# EAGLE design LP55231_breakout (EAGLE 7.5.0)
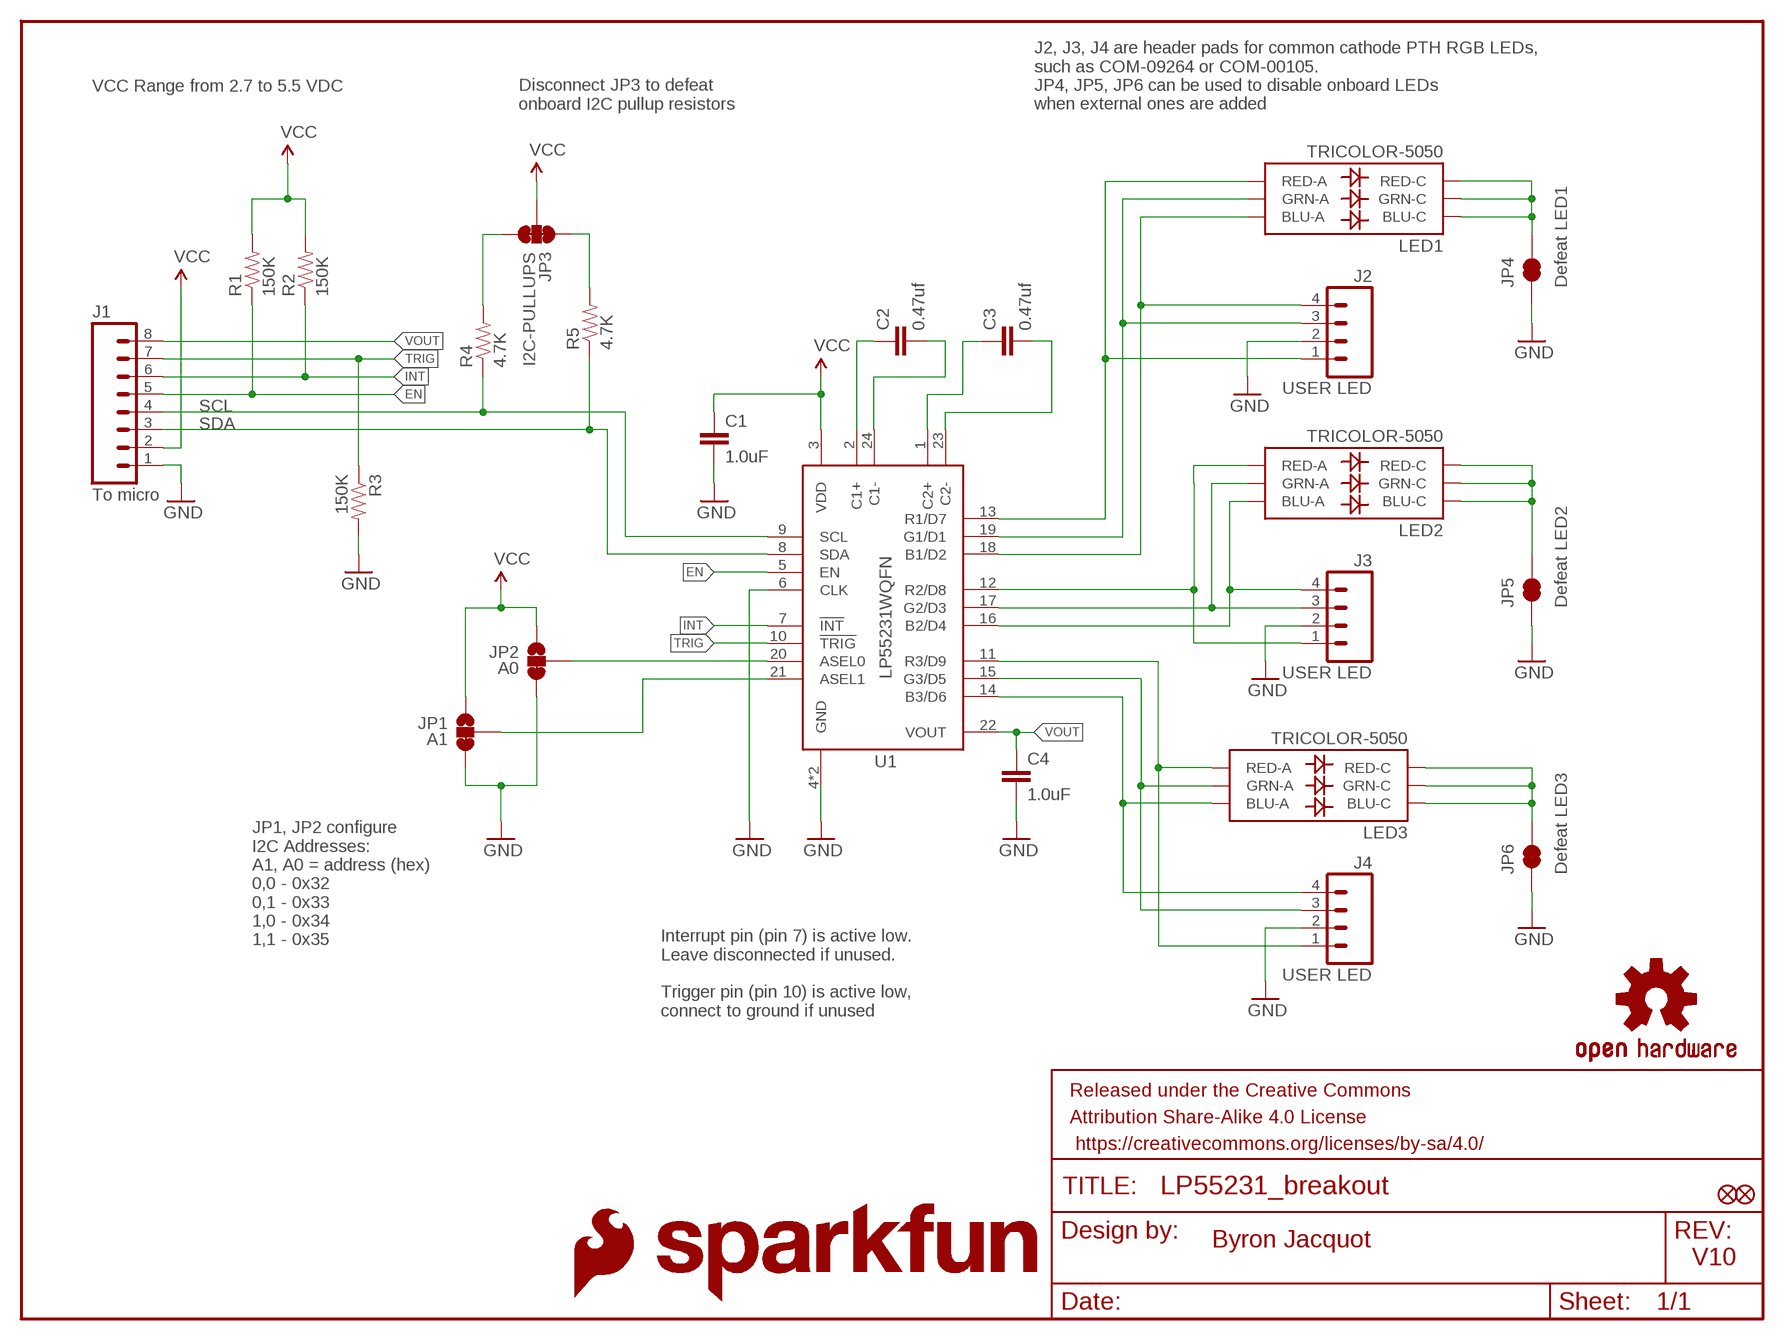
[diagram p0: schematic, sheet 1]

## Parts
C1  1.0uF  1.0UF-16V-10%(0603)  [0603-CAP]
C2  0.47uf  CAP0603-CAP  [0603-CAP]
C3  0.47uf  CAP0603-CAP  [0603-CAP]
C4  1.0uF  1.0UF-16V-10%(0603)  [0603-CAP]
FD1  FIDUCIALUFIDUCIAL  [MICRO-FIDUCIAL]
FD2  FIDUCIALUFIDUCIAL  [MICRO-FIDUCIAL]
FRAME1  FRAME-LETTER  [CREATIVE_COMMONS]
J1  To micro  M08NO_SILK_FEMALE_PTH  [1X08_NO_SILK]
J2  USER LED  M04NO_SILK_ALL_ROUND  [1X04_NO_SILK_ALL_ROUND]
J3  USER LED  M04NO_SILK_ALL_ROUND  [1X04_NO_SILK_ALL_ROUND]
J4  USER LED  M04NO_SILK_ALL_ROUND  [1X04_NO_SILK_ALL_ROUND]
JP1  A1  JUMPER-PAD-3-2OF3_NC_BY_TRACE_SMALL  [PAD-JUMPER-3-2OF3_NC_BY_TRACE_YES_SILK_FULL_BOX]
JP2  A0  JUMPER-PAD-3-2OF3_NC_BY_TRACE_SMALL  [PAD-JUMPER-3-2OF3_NC_BY_TRACE_YES_SILK_FULL_BOX]
JP3  I2C-PULLUPS  JUMPER-PAD-3-NC_BY_TRACE  [PAD-JUMPER-3-3OF3_NC_BY_TRACE_YES_SILK_FULL_BOX]
JP4  Defeat LED1  JUMPER-PAD-2-NC_BY_TRACENO_SILK  [PAD-JUMPER-2-NC_BY_TRACE_NO_SILK]
JP5  Defeat LED2  JUMPER-PAD-2-NC_BY_TRACENO_SILK  [PAD-JUMPER-2-NC_BY_TRACE_NO_SILK]
JP6  Defeat LED3  JUMPER-PAD-2-NC_BY_TRACENO_SILK  [PAD-JUMPER-2-NC_BY_TRACE_NO_SILK]
LED1  TRICOLOR-5050  LED-TRICOLOR-5050NO_IC  [LED-TRICOLOR-5050]
LED2  TRICOLOR-5050  LED-TRICOLOR-5050NO_IC  [LED-TRICOLOR-5050]
LED3  TRICOLOR-5050  LED-TRICOLOR-5050NO_IC  [LED-TRICOLOR-5050]
LOGO1  SFE_LOGO_FLAME.1_INCH  [SFE_LOGO_FLAME_.1]
LOGO2  SFE_LOGO_NAME.1_INCH  [SFE_LOGO_NAME_.1]
LOGO3  OSHW-LOGOS  [OSHW-LOGO-S]
R1  150K  150KOHM1/10W1%(0603)  [0603-RES]
R2  150K  150KOHM1/10W1%(0603)  [0603-RES]
R3  150K  150KOHM1/10W1%(0603)  [0603-RES]
R4  4.7K  4.7KOHM-1/10W-1%(0603)  [0603-RES]
R5  4.7K  4.7KOHM-1/10W-1%(0603)  [0603-RES]
U1  LP55231WQFN  [WQFN-24]

## Nets
ADDR0: JP2.2 U1.20(ASEL0)
ADDR1: JP1.2 U1.21(ASEL1)
B1: J2.4 LED1.3(BLU-A) U1.18(B1/D2)
B2: J3.4 LED2.3(BLU-A) U1.16(B2/D4)
B3: J4.4 LED3.3(BLU-A) U1.14(B3/D6)
EN: J1.5 R1.1 U1.5(EN)
G1: J2.3 LED1.1(GRN-A) U1.19(G1/D1)
G2: J3.3 LED2.1(GRN-A) U1.17(G2/D3)
G3: J4.3 LED3.1(GRN-A) U1.15(G3/D5)
GND: C1.2 C4.2 J1.1 J2.2 J3.2 J4.2 JP1.3 JP2.3 JP4.1 JP5.1 JP6.1 R3.2 U1.4(GND) U1.6(CLK) U1.EP(GND)
INT: J1.6 R2.1 U1.7(!INT)
N$1: JP6.2 LED3.4(BLU-C) LED3.5(RED-C) LED3.6(GRN-C)
N$2: JP5.2 LED2.4(BLU-C) LED2.5(RED-C) LED2.6(GRN-C)
N$3: JP4.2 LED1.4(BLU-C) LED1.5(RED-C) LED1.6(GRN-C)
N$11: C2.1 U1.2(C1+)
N$12: C2.2 U1.24(C1-)
N$13: C3.1 U1.1(C2+)
N$14: C3.2 U1.23(C2-)
N$21: JP3.1 R5.2
N$22: JP3.3 R4.2
R1: J2.1 LED1.2(RED-A) U1.13(R1/D7)
R2: J3.1 LED2.2(RED-A) U1.12(R2/D8)
R3: J4.1 LED3.2(RED-A) U1.11(R3/D9)
SCL: J1.4 R4.1 U1.9(SCL)
SDA: J1.3 R5.1 U1.8(SDA)
TRIG: J1.7 R3.1 U1.10(!TRIG)
VCC: C1.1 J1.2 JP1.1 JP2.1 JP3.2 R1.2 R2.2 U1.3(VDD)
VOUT: C4.1 J1.8 U1.22(VOUT)

## Notes on the sheet
- VCC Range from 2.7 to 5.5 VDC
- Disconnect JP3 to defeat
  onboard I2C pullup resistors
- J2, J3, J4 are header pads for common cathode PTH RGB LEDs,
  such as COM-09264 or COM-00105.  
  JP4, JP5, JP6 can be used to disable onboard LEDs 
  when external ones are added
- JP1, JP2 configure
  I2C Addresses:
  A1, A0 = address (hex)
  0,0 - 0x32
  0,1 - 0x33
  1,0 - 0x34
  1,1 - 0x35
- Interrupt pin (pin 7) is active low.  
  Leave disconnected if unused.
  
  Trigger pin (pin 10) is active low, 
  connect to ground if unused
- Byron Jacquot
- V10

## Library data of the parts
C1 C4 = SparkFun-Capacitors:1.0UF-16V-10%(0603): CAP-00868; PROD_ID: CAP-00868
C2 = SparkFun-Capacitors:CAP: Capacitor Standard 0603 ceramic capacitor, and 0.1" leaded capacitor.; PROD_ID: CAP-13216; SEE-ALSO: battery-babysitter
C3 = SparkFun-Capacitors:CAP: Capacitor Standard 0603 ceramic capacitor, and 0.1" leaded capacitor.; PROD_ID: CAP-13216; SEE-ALSO: battery bayasitter
FD1 FD2 = SparkFun-Aesthetics:FIDUCIAL: Fiducial Alignment Points Various fiducial points for machine vision alignment.
FRAME1 = SparkFun-Aesthetics:FRAME-LETTER: Schematic Frame Standard 8.5x11 US Letter frame
J1 = SparkFun-Connectors:M08: Header 8 Standard 8-pin 0.1" header. Use with straight break away headers (SKU : PRT-00116), right angle break away headers (PRT-00553), swiss pins (PRT-00743), machine pins (PRT-00117), and female headers (PRT-00115).; PROD_ID: CONN-08438
J2-J4 = SparkFun-Connectors:M04: Header 4 Standard 4-pin 0.1" header. Use with straight break away headers (SKU : PRT-00116), right angle break away headers (PRT-00553), swiss pins (PRT-00743), machine pins (PRT-00117), and female headers (PRT-00115). Molex polarized connector foot print use with SKU : PRT-08231 with associated crimp pins and housings. 1MM SMD Version SKU: PRT-10208; PROD_ID: CONN-09696
JP1 JP2 = SparkFun-Passives:JUMPER-PAD-3-2OF3_NC_BY_TRACE
JP3 = SparkFun-Passives:JUMPER-PAD-3-NC_BY_TRACE
JP4-JP6 = SparkFun-Passives:JUMPER-PAD-2-NC_BY_TRACE
LED1-LED3 = SparkFun-LED:LED-TRICOLOR-5050; PROD_ID: DIO-10298
LOGO1 = SparkFun-Aesthetics:SFE_LOGO_FLAME: SFE Logo, flame only This is the SparkFun flame logo. The logo on the schematic will always be the same size; the package variant is the height of the flame. Default layer for the logo on the board is tSilk.
LOGO2 = SparkFun-Aesthetics:SFE_LOGO_NAME: SFE Logo, name only This is the SparkFun name logo. The logo on the schematic will always be the same size; the package variant is the height of the flame part of the logo (or the height the flame would be, if it were drawn). Default layer for the logo on the board is tSilk.
LOGO3 = SparkFun-Aesthetics:OSHW-LOGO: Open Source Hardware Logo This logo indicates the piece of hardware it is found on incorporates a OSHW license and/or adheres to the definition of open source hardware found here: http://freedomdefined.org/OSHW
R1-R3 = SparkFun-Resistors:150KOHM1/10W1%(0603): RES-09117; PROD_ID: RES-09117
R4 R5 = SparkFun-Resistors:4.7KOHM-1/10W-1%(0603): RES-07857; PROD_ID: RES-07857
U1 = LP55231:LP55231; PROD_ID: IC-13302

## Board
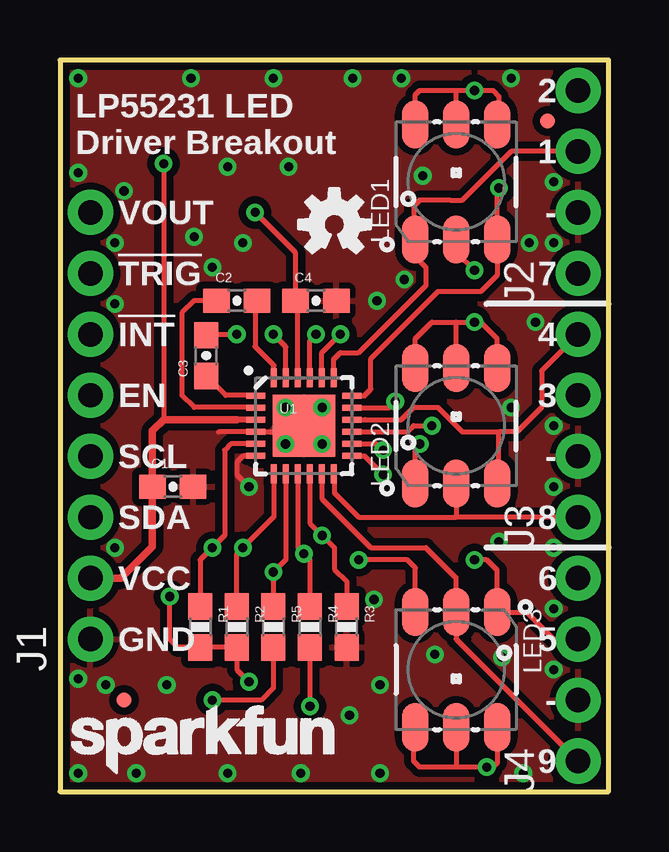
[diagram p1: board, top side]
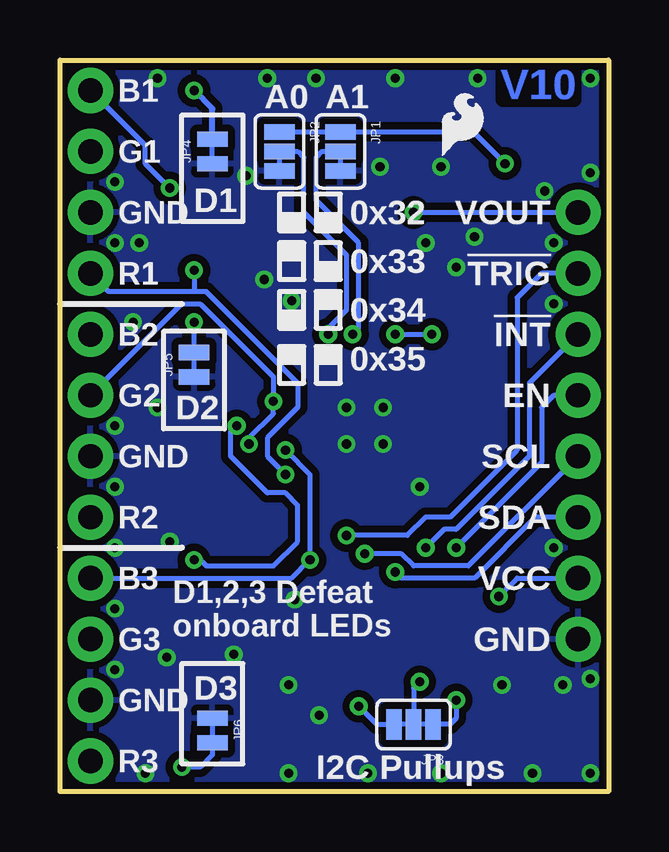
[diagram p2: board, bottom side, seen from below]

Size 22.86 x 30.48 mm. Coordinates in mm from the lower left corner, seen from the top.
Outline: 0,0 22.86,0 22.86,30.48 0,30.48 0,0
Copper layers (1*2*15*16): Top 0.035559375mm / dielectric 0.47751875mm / Route2 0.035559375mm / dielectric 0.47751875mm / Route15 0.035559375mm / dielectric 0.47751875mm / Bottom 0.035559375mm
Design rules "SparkFun-4-layer-TIGHT": minimum track width 7mil, minimum drill 15mil, track to track 7mil, track to pad 7mil, pad to pad 7mil, via to via 7mil, smd to smd 7mil, copper to edge 7mil, drill to drill 7mil, minimum pad ring 7mil, minimum via ring 7mil, stop-mask expansion 4mil, vias tented up to drill 25mil, thermal gap 10mil
tRestrict: area 8.1,13.8 to 8.8,13.8

### Footprints (pad centres in the part's own frame; a part is rotated, then mirrored left to right if it is on the bottom)
0603-CAP = smd 1.1 x 1: 1 -0.85,0; 2 0.85,0
MICRO-FIDUCIAL = smd 0.635 x 0.635: 1 0,0
1X08_NO_SILK = drill 1.016 pad 1.88: 1 0,0; 2 2.54,0; 3 5.08,0; 4 7.62,0; 5 10.16,0; 6 12.7,0; 7 15.24,0; 8 17.78,0
1X04_NO_SILK_ALL_ROUND = drill 1.016 pad 1.88: 1 0,0; 2 2.54,0; 3 5.08,0; 4 7.62,0
PAD-JUMPER-3-2OF3_NC_BY_TRACE_YES_SILK_FULL_BOX = smd 0.635 x 1.27: 1 -0.813,0; 2 0,0; 3 0.813,0
PAD-JUMPER-3-3OF3_NC_BY_TRACE_YES_SILK_FULL_BOX = smd 0.635 x 1.27: 1 -0.813,0; 2 0,0; 3 0.813,0
PAD-JUMPER-2-NC_BY_TRACE_NO_SILK = smd 0.635 x 1.27: 1 -0.508,0; 2 0.508,0
LED-TRICOLOR-5050 = smd 2 x 1.1: 1 -2.4,1.7; 2 -2.4,0; 3 -2.4,-1.7; 4 2.4,-1.7; 5 2.4,0; 6 2.4,1.7
0603-RES = smd 1.1 x 1: 1 -0.85,0; 2 0.85,0
WQFN-24 = smd 0.8 x 0.25: 1 -2,1.25; 2 -2,0.75; 3 -2,0.25; 4 -2,-0.25; 5 -2,-0.75; 6 -2,-1.25; 13 2,-1.25; 14 2,-0.75; 15 2,-0.25; 16 2,0.25; 17 2,0.75; 18 2,1.25 | smd 0.25 x 0.8: 7 -1.25,-2; 8 -0.75,-2; 9 -0.25,-2; 10 0.25,-2; 11 0.75,-2; 12 1.25,-2; 19 1.25,2; 20 0.75,2; 21 0.25,2; 22 -0.25,2; 23 -0.75,2; 24 -1.25,2 | smd 2.6 x 2.6: EP 0,0

### Placement (x,y rotation side)
C1  4.7,12.7 0 top
C2  7.37,20.45 0 top
C3  6.1,18.16 90 top
C4  10.67,20.45 0 top
FD1  20.32,27.94 0 top
FD2  2.67,3.81 0 top
FRAME1  21.59,-10.16 0 top  (outside the outline)
J1  1.27,6.35 90 top
J2  21.59,21.59 90 top
J3  21.59,11.43 90 top
J4  21.59,1.27 90 top
JP1  11.18,26.67 270 bottom
JP2  13.72,26.67 270 bottom
JP3  8.13,2.79 180 bottom
JP4  16.51,26.67 90 bottom
JP5  17.27,17.78 90 bottom
JP6  16.51,2.54 270 bottom
LED1  16.51,25.4 90 top
LED2  16.51,15.24 90 top
LED3  16.51,5.08 270 top
LOGO1  7.24,26.16 0 bottom
LOGO2  0,0.25 0 top
LOGO3  11.43,23.62 0 top
R1  5.84,6.86 270 top
R2  7.37,6.86 270 top
R3  11.94,6.86 270 top
R4  10.41,6.86 270 top
R5  8.89,6.86 270 top
U1  10.16,15.24 0 top

### Tracks (layer width: path | path; a pad name or v marks a point on that pad's centre or on a via)
ADDR0  (via drill 0.38)
  Top 0.203: v11.68,19.05 10.91,18.28 U1.20
  Bottom 0.203: v11.68,19.05 11.68,19.3 10.92,20.07 10.92,22.35 12.7,24.13 12.7,26.42 12.95,26.67 JP2.2
ADDR1  (via drill 0.38)
  Top 0.203: U1.21 10.41,18.79 v10.67,19.05
  Bottom 0.203: JP1.2 11.94,26.67 12.19,26.42 12.19,24.64 10.41,22.86 10.41,19.3 v10.67,19.05
B1  (via drill 0.38)
  Top 0.203: U1.18 12.68,16.49 12.95,16.76 12.95,18.03 15.75,20.83 17.53,20.83 18.21,21.51 LED1.3 18.21,25.07 v18.29,25.15
  Bottom 0.203: v18.29,25.15 19.3,26.16 19.3,26.92 J2.4
B2
  Top 0.203: 18.29,14.99 16.76,14.99 15.75,16 14.73,16 14.22,15.49 12.7,15.49 U1.16 | J3.4 20.07,17.53 20.07,16 19.05,14.99 18.29,14.99 | LED2.3 18.21,13.38 18.29,13.46 18.29,14.99
B3  (via drill 0.38)
  Top 0.203: U1.14 13.2,14.49 v13.46,14.22 | LED3.3 14.81,9.32 14.48,9.65 v12.45,9.65
  Bottom 0.203: v13.46,14.22 12.45,13.21 v12.45,9.65 13.21,8.89 J4.4
EN  (via drill 0.38)
  Top 0.203: U1.5 7.12,14.49 6.86,14.22 6.86,10.67 v6.35,10.16 5.84,9.65 R1.1
  Bottom 0.203: J1.5 2.29,16.51 2.79,16 2.79,13.72 v6.35,10.16
G1
  Top 0.203: U1.19 11.41,18.01 11.68,18.29 12.45,18.29 15.24,21.08 15.24,21.84 14.81,22.27 LED1.1 14.73,23.08 14.73,24.38 14.99,24.64 16.26,24.64 16.76,24.64 18.8,26.67 J2.3
G2  (via drill 0.38)
  Top 0.203: U1.17 13.7,15.99 v13.97,16.26 | LED2.1 14.81,14.3 v14.99,14.48
  Bottom 0.203: J3.3 17.78,20.32 17.02,20.32 13.97,17.27 v13.97,16.26 13.97,15.75 14.99,14.73 v14.99,14.48
G3  (via drill 0.38)
  Top 0.203: J4.3 20.57,6.35 19.44,7.48 LED3.1 18.21,9.22 17.78,9.65 v17.27,9.65 | U1.15 14.47,14.99 14.48,14.99 14.74,15.24 v15.49,15.24
  Bottom 0.203: v17.27,9.65 17.02,9.65 16.76,9.4 13.97,9.4 12.95,10.41 12.95,11.94 13.46,12.45 14.22,12.45 15.75,13.97 15.75,14.99 v15.49,15.24
GND  (via drill 0.38)
  Top 0.203: U1.EP v10.92,14.48 | 8.13,13.96 U1.6 7.64,13.99 7.37,13.72 7.37,13.21 v7.87,12.7 | 6.61,14.99 U1.4 9.14,14.99
  Top 0.254: v9.4,14.48 9.14,14.73 9.14,14.99 9.14,15.74 v9.4,16 9.4,14.99
  other vias: 10.92,16 0.76,25.78 19.3,0.76 0.76,4.7 0.76,0.76 3.17,0.76 13.34,0.76 13.34,4.45 12.06,3.17 4.45,4.45 1.91,4.45 2.67,25.02 9.53,26.04 6.99,26.04 8.89,29.72 18.8,29.72 7.62,22.86 5.59,23.11 6.35,21.84 10.03,0.76 18.29,10.41 20.57,15.24 14.22,29.72 12.19,29.72 0.76,29.72 13.08,8 2.29,20.32 2.29,22.86 5.46,29.72 14.35,21.34 20.57,22.86 18.8,16 19.81,19.56 6.99,0.76 18.41,5.59 20.57,5.08 20.57,7.62 20.57,12.7 20.57,10.16 20.57,25.4 19.56,22.86 2.29,10.16 15.62,5.71 15.11,25.65 13.21,20.45
  pour Top (isolate 0.305): 0,30.48 22.86,30.48 22.86,0 0,0
  pour Bottom (isolate 0.305): 22.86,30.48 0,30.48 0,0 22.86,0
INT  (via drill 0.38)
  Top 0.203: R2.1 7.37,9.91 v7.62,10.16 8.91,11.45 U1.7
  Bottom 0.203: J1.6 3.3,17.02 3.3,13.97 6.35,10.92 6.86,10.92 v7.62,10.16
N$1  (via drill 0.38)
  Top 0.203: LED3.6 18.21,1.19 18.03,1.02 v17.78,1.02 16.51,1.02 | 16.51,1.02 14.99,1.02 14.73,1.27 14.73,2.6 LED3.4 | LED3.5 16.51,1.02
  Bottom 0.203: JP6.2 16.51,1.52 17.02,1.02 v17.78,1.02
N$2  (via drill 0.38)
  Top 0.203: LED2.4 18.21,18.87 18.03,19.05 17.53,19.56 v17.27,19.56 17.02,19.56 16.51,19.56 | LED2.6 14.81,18.87 15.49,19.56 16.51,19.56 | LED2.5 16.51,19.56
  Bottom 0.203: JP5.2 v17.27,19.56
N$3  (via drill 0.38)
  Top 0.203: LED1.6 14.81,29.03 14.99,29.21 16.51,29.21 | 16.51,29.21 v17.27,29.21 18.03,29.21 18.29,28.96 18.29,27.88 LED1.4 | LED1.5 16.51,29.21
  Bottom 0.254: JP4.2 16.51,28.45 v17.27,29.21
N$11
  Top 0.203: C2.1 5.59,20.45 5.08,19.94 5.08,16.51 5.59,16 8.15,16 U1.2
N$12
  Top 0.203: U1.24 8.91,17.76 8.13,18.54 8.13,20.36 C2.2
N$13
  Top 0.203: U1.1 8.14,16.51 6.9,16.51 C3.1 6.1,17.02
N$14  (via drill 0.38)
  Top 0.203: U1.23 9.41,18.53 v8.89,19.05 | C3.2 6.13,19.05 v7.37,19.05
  Bottom 0.203: v8.89,19.05 v7.37,19.05
N$21  (via drill 0.38)
  Top 0.203: R5.2 8.89,4.32 8.38,3.81 v6.35,3.81
  Bottom 0.203: v6.35,3.81 6.35,3.05 6.6,2.79 JP3.1
N$22  (via drill 0.38)
  Top 0.203: R4.2 v10.41,3.56
  Bottom 0.203: v10.41,3.56 9.65,2.79 JP3.3
R1  (via drill 0.38)
  Top 0.203: U1.13 12.68,13.99 v13.46,13.21 | LED1.2 16.51,22.48 v17.27,21.72
  Bottom 0.203: v13.46,13.21 14.22,13.97 14.22,14.73 12.95,16 12.95,17.02 16.76,20.83 17.27,20.83 | 17.27,20.83 20.83,20.83 J2.1 | v17.27,21.72 17.27,20.83
R2
  Top 0.203: U1.12 11.43,13.22 11.43,12.45 12.45,11.43 16.51,11.43 | J3.1 16.51,11.43 | LED2.2 16.51,11.43
R3
  Top 0.203: U1.11 10.91,12.2 12.95,10.16 15.24,10.16 16.51,8.89 LED3.2 16.51,6.35 J4.1
SCL  (via drill 0.38)
  Top 0.203: R4.1 10.41,9.65 v10.16,9.91 9.91,10.16 U1.9
  Bottom 0.203: v10.16,9.91 8.64,9.91 8.13,9.4 5.84,9.4 J1.4
SDA  (via drill 0.38)
  Top 0.203: R5.1 v8.89,9.14 9.41,9.66 U1.8
  Bottom 0.203: J1.3 3.05,11.43 5.59,8.89 8.64,8.89 v8.89,9.14
TRIG  (via drill 0.38)
  Top 0.203: R3.1 11.94,8.76 11.43,9.27 11.43,10.16 v10.92,10.67 10.41,11.18 U1.10
  Bottom 0.203: J1.7 2.79,21.59 3.81,20.57 3.81,14.22 6.6,11.43 7.62,11.43 8.38,10.67 v10.92,10.67
VCC  (via drill 0.38)
  Top 0.203: v4.32,26.16 4.32,15.49 | U1.3 | v7.87,4.57 7.37,5.08 R2.2 R1.2 4.91,6.01 4.57,6.35 v4.57,8.13
  Top 0.254: U1.3 7.37,15.49
  Top 0.305: J1.2 2.54,8.89 3.85,10.2 C1.1 3.85,15.03 4.32,15.49 7.37,15.49
  Bottom 0.203: JP2.1 JP1.1 5.64,27.48 v4.32,26.16 | v7.87,4.57 8.13,4.32 JP3.2 | J1.2 3.81,8.89 v4.57,8.13
VOUT  (via drill 0.38)
  Top 0.203: v8.13,24.13 9.82,22.44 C4.1 9.91,20.36 U1.22
  Bottom 0.203: v8.13,24.13 J1.8

### Text on the board
Bottom: V10
tPlace: 2 | LP55231 LED / Driver Breakout | 1 | VOUT | - | !TRIG | 7 | !INT | 4 | EN | 3 | SCL | - | SDA | 8 | VCC | 6 | GND | 5 | - | 9
bPlace: A1 | A0 | B1 | G1 | D1 | VOUT | 0x32 | GND | !TRIG | 0x33 | R1 | 0x34 | !INT | B2 | 0x35 | EN | D2 | G2 | SCL | GND | SDA | R2 | VCC | B3 | D1,2,3 Defeat / onboard LEDs | GND | G3 | D3 | GND | I2C Pullups | R3
Measures: All Dimensions In Inches
tDocu: Byron Jacquot